# Altium schematic sheet REC.SchDoc
size A3; Organization: Altium Limited; Address1: L3, 12a Rodborough Rd; Address2: Frenchs Forest; Address3: NSW; Address4: Australia 2086
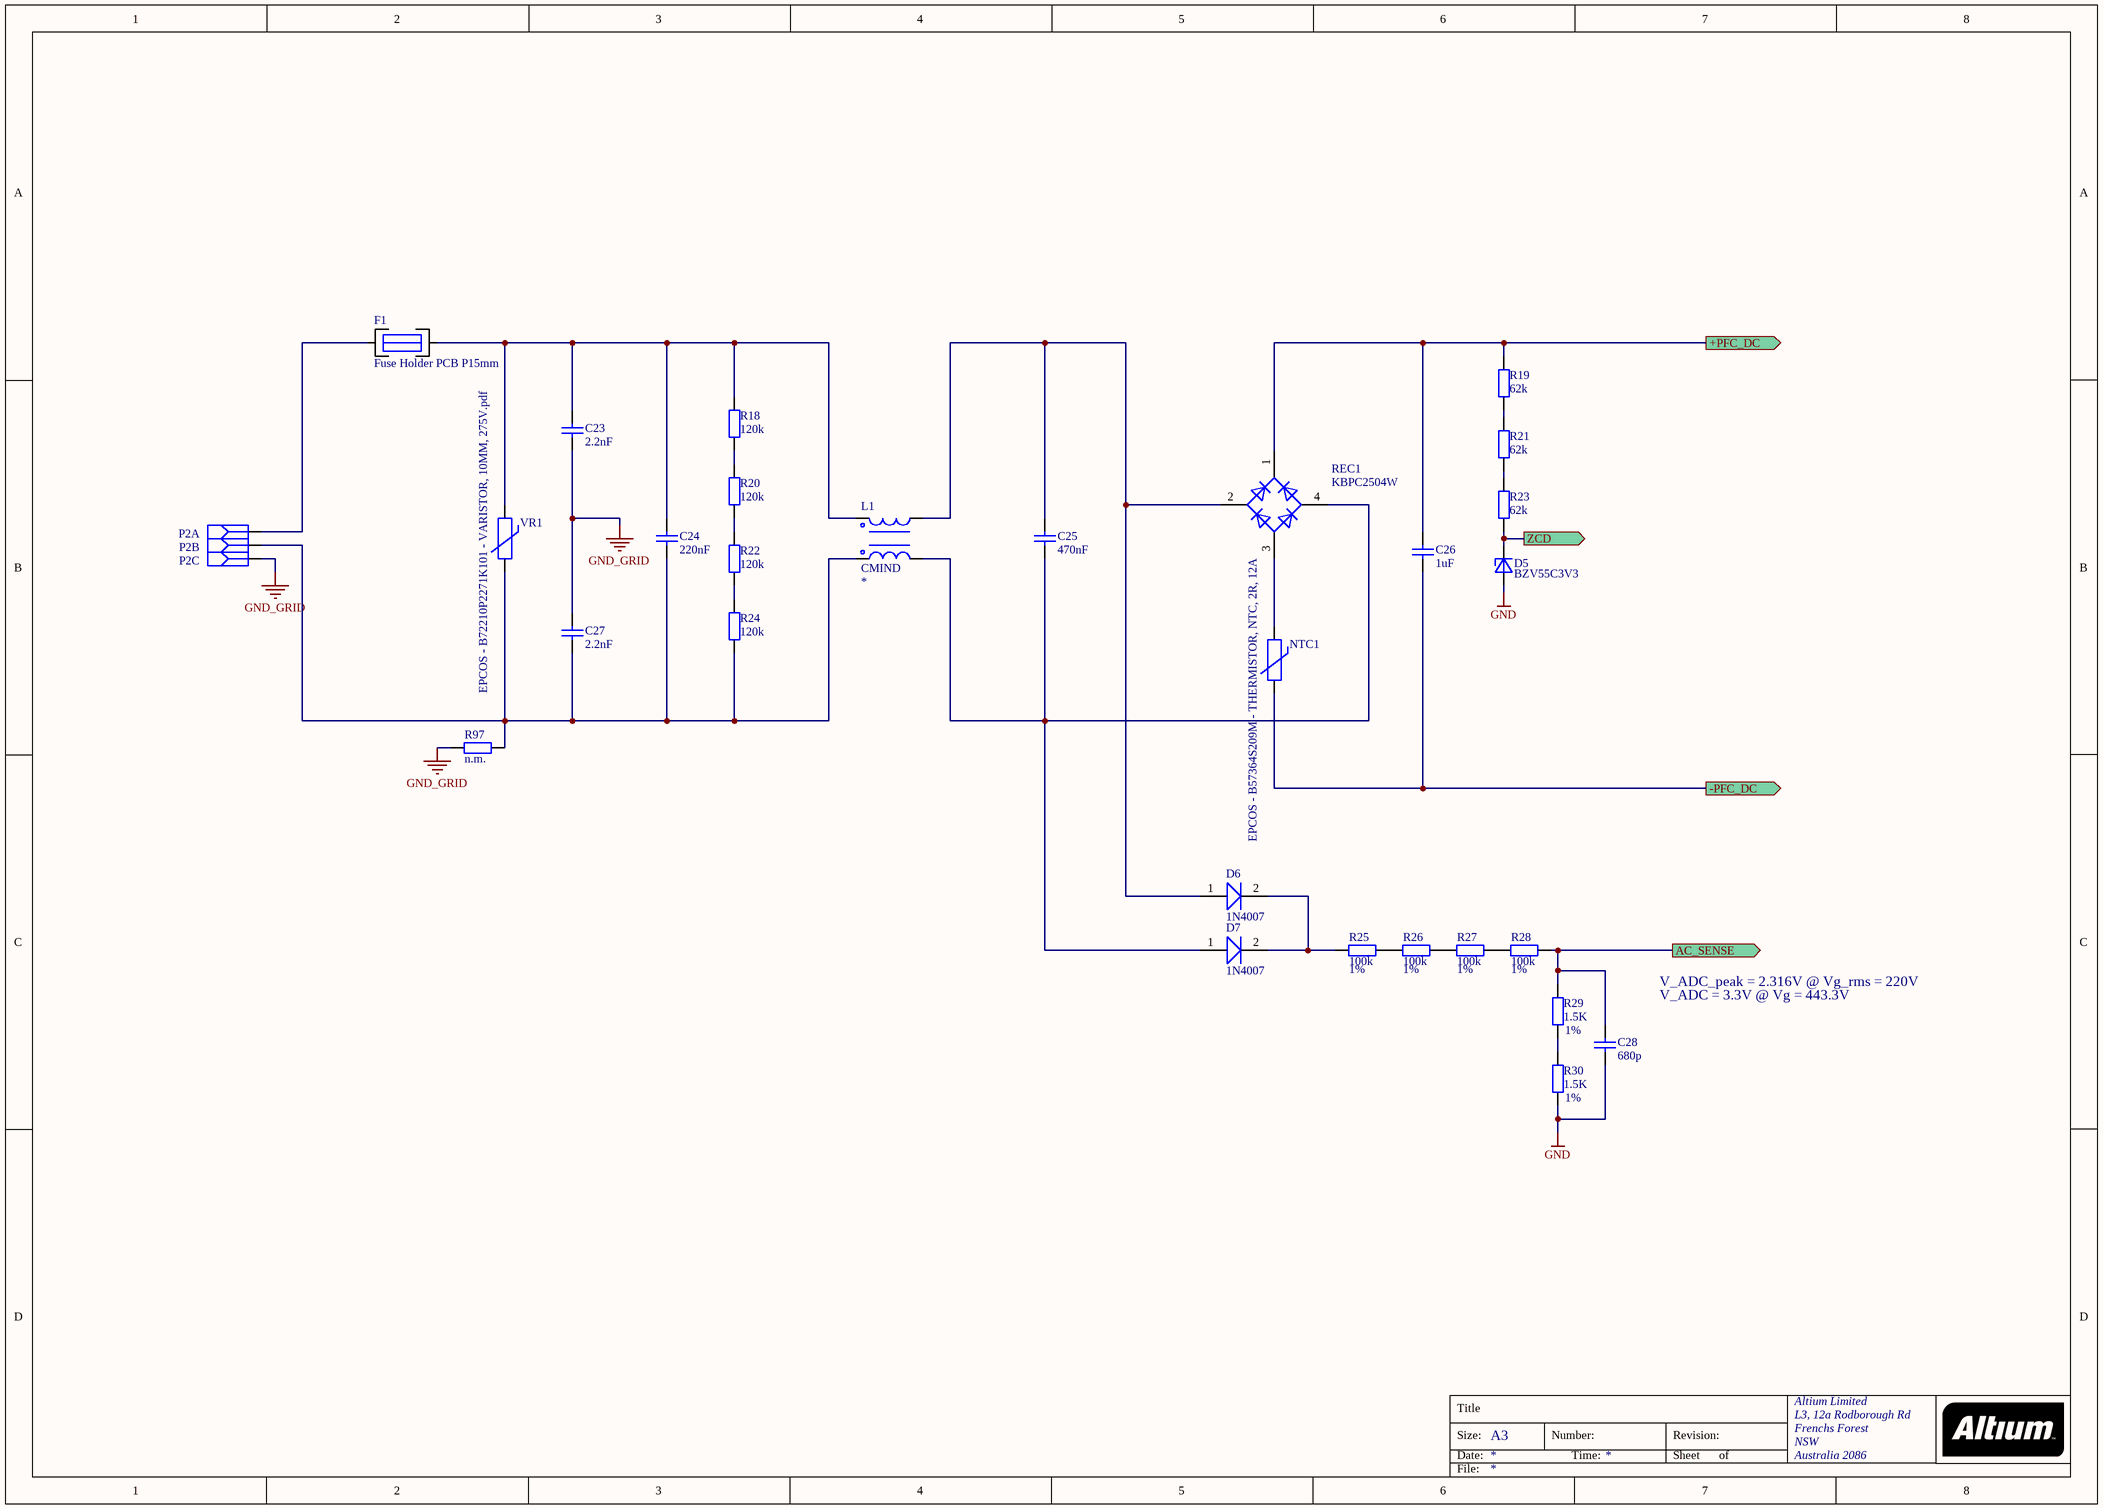
[diagram p0: REC.SchDoc]

## Parts
C23  value 2.2nF  [RECT 18.0X7.0 RM15.0]  (hidden comment: Cap)
C24  value 220nF  [RECT 18.0X7.0 RM15.0]  (hidden comment: Cap)
C25  value 470nF  [RECT 18.0X7.0 RM15.0]  (hidden comment: Cap)
C26  value 1uF  [RECT 18.0X7.0 RM15.0]  (hidden comment: Cap)
C27  value 2.2nF  [RECT 18.0X7.0 RM15.0]  (hidden comment: Cap)
C28  value 680p  [1206_REFLOW]  (hidden comment: Cap 1206)
D5  value BZV55C3V3  [D_MINIMELF_BZV55C5V1(Primary)]  (hidden comment: BZV55CXXX)
D6  1N4007  [AFL-W2/X1.8D]
D7  1N4007  [AFL-W2/X1.8D]
F1  Fuse Holder PCB P15mm  [Fuse Holder PCB P15mm]
L1  CMIND  [CommonModeChoke]
NTC1  value EPCOS - B57364S209M - THERMISTOR, NTC, 2R, 12A  [VARISTOR_14]  (hidden comment: Varristor)
P2  MSTBA 2,5/ 3-G-5,08  [MSTBA2.5/3G-5.08]  (value not drawn)  (parts A,B,C of 3)
R18  value 120k  [1206_REFLOW]  (hidden comment: RES)
R19  value 62k  [RA161004]  (hidden comment: RES)
R20  value 120k  [1206_REFLOW]  (hidden comment: RES)
R21  value 62k  [RA161004]  (hidden comment: RES)
R22  value 120k  [1206_REFLOW]  (hidden comment: RES)
R23  value 62k  [RA161004]  (hidden comment: RES)
R24  value 120k  [1206_REFLOW]  (hidden comment: RES)
R25  value 100k  Tolerance: 1%  [RA161004]  (hidden comment: RES)
R26  value 100k  Tolerance: 1%  [RA161004]  (hidden comment: RES)
R27  value 100k  Tolerance: 1%  [RA161004]  (hidden comment: RES)
R28  value 100k  Tolerance: 1%  [RA161004]  (hidden comment: RES)
R29  value 1.5K  Tolerance: 1%  [RA161004]  (hidden comment: RES)
R30  value 1.5K  Tolerance: 1%  [RA161004]  (hidden comment: RES)
R97  value n.m.  [1206_REFLOW]  (hidden comment: RES)
REC1  KBPC2504W  [KBPC2504W]
VR1  value EPCOS - B72210P2271K101 - VARISTOR, 10MM, 275V.pdf  [VARISTOR_14]  (hidden comment: Varristor)

## Ports
+PFC_DC (out), -PFC_DC (out), AC_SENSE (out), ZCD (out)

## Nets
GND: C28.1 D5.A R30.2
GND_GRID: C23.1 C27.2 P2.3(SIG) R97.1
+PFC_DC: C26.2 R19.1 REC1.1(K) ; port +PFC_DC
-PFC_DC: C26.1 NTC1.2 ; port -PFC_DC
AC_SENSE: C28.2 R28.2 R29.1 ; port AC_SENSE
ZCD: D5.K R23.2 ; port ZCD
NetC23_2: C23.2 C24.2 F1.2 L1.1 R18.1 VR1.1
NetC24_1: C24.1 C27.1 L1.3 P2.2(SIG) R24.2 R97.2 VR1.2
NetC25_1: C25.1 D7.1(A) L1.4 REC1.4(C)
NetC25_2: C25.2 D6.1(A) L1.2 REC1.2(C)
NetD6_2: D6.2(K) D7.2(K) R25.1
NetF1_1: F1.1 P2.1(SIG)
NetNTC1_1: NTC1.1 REC1.3(A)
NetR18_2: R18.2 R20.1
NetR19_2: R19.2 R21.1
NetR20_2: R20.2 R22.1
NetR21_2: R21.2 R23.1
NetR22_2: R22.2 R24.1
NetR25_2: R25.2 R26.1
NetR26_2: R26.2 R27.1
NetR27_2: R27.2 R28.1
NetR29_2: R29.2 R30.1

## Notes on the sheet
- V_ADC_peak = 2.316V @ Vg_rms = 220V
- V_ADC = 3.3V @ Vg = 443.3V
- Title
- Size:
- Date:
- A3
- Number:
- Time:
- Revision:
- Sheet
- of
- File:

## Library data of the parts
D5 = BZV55CXXX: Zener Diode
D6 D7 = 1N4007: 1.0 Ampere General Purpose Rectifier; ComponentField6: Published 8-Jun-2000, Modified 11-July-2000: SIM Model Added.; OriginalName: 1N4007; Value: 1N4007
NTC1 VR1 = VAR
  NTC1: Farnell Order Number: 1688802
  VR1: Farnell Order Number: 1781925
P2 = MSTBA 2,5/ 3-G-5,08: Header, right angled, 12 A, 250 V, pitch 5.08 mm, No. of poles:4; Manufacturer: Phoenix; Mfrr. Part No.: 1757268; Group: Connector; Subgroup: Industrial; Value: MSTBA2,5/3; Mounting: TH; Supplier: Any; Order Code: *
R18 R20 R22 R24-R30 R97 = RES 1
  R97: Tolerance: *
R19 R21 R23 = RES 1: Tolerance: 1%
F1 = Fuse Holder PCB P15mm: Value: Fuse Holder PCB P15mm
L1 = CMIND: Value: *
REC1 = KBPC2504W: Value: KBPC2504W